# EAGLE design uBoard breakoutboard (EAGLE 5.00)
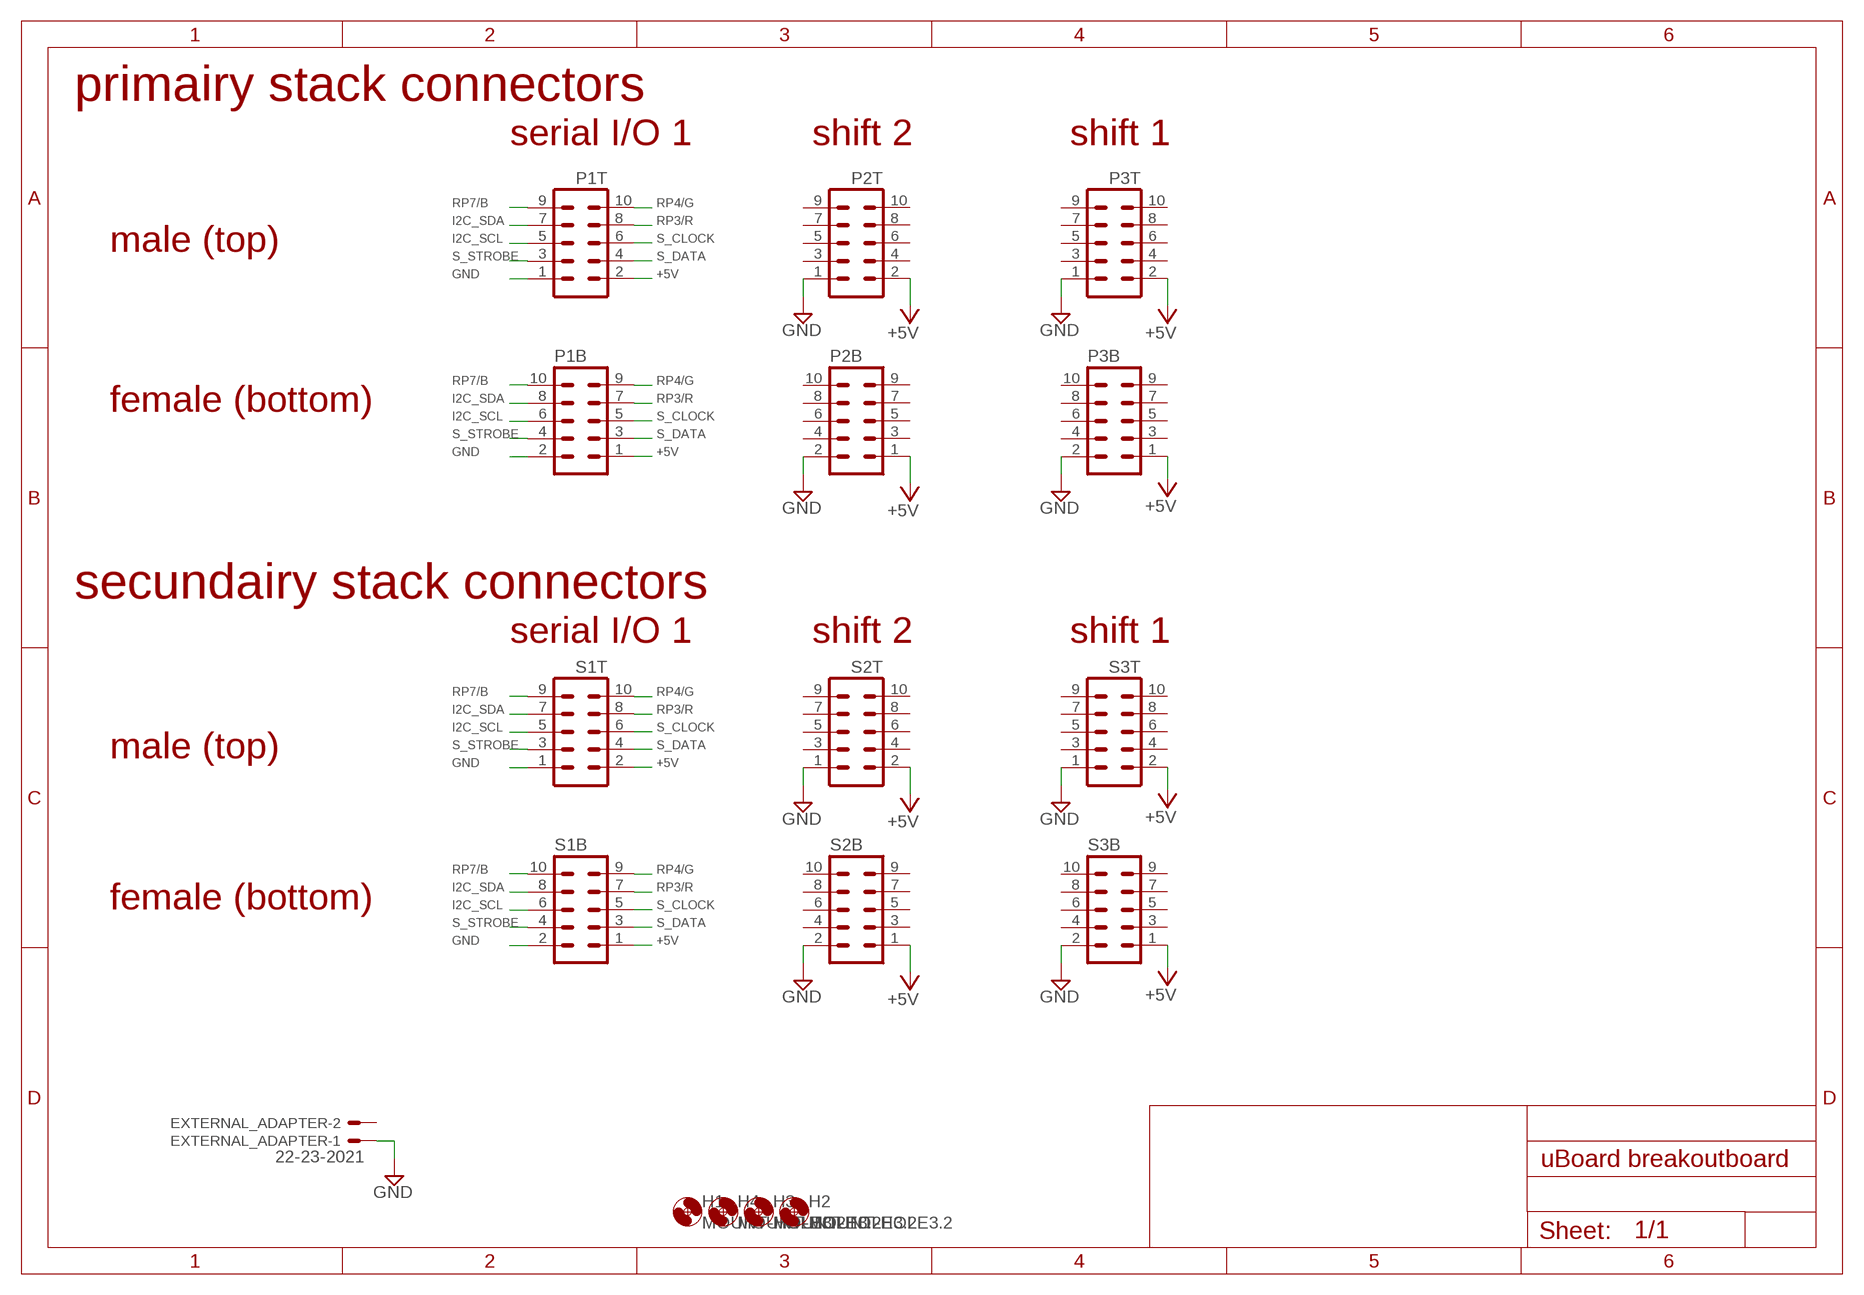
[diagram p0: schematic, sheet 1]

## Parts
EXTERNAL_ADAPTER  22-23-2021  [22-23-2021]
H1  MOUNT-HOLE3.2  [3,2]
H2  MOUNT-HOLE3.2  [3,2]
H3  MOUNT-HOLE3.2  [3,2]
H4  MOUNT-HOLE3.2  [3,2]
P1B  ML10  [ML10]
P1T  MA05-2  [MA05-2]
P2B  ML10  [ML10]
P2T  MA05-2  [MA05-2]
P3B  ML10  [ML10]
P3T  MA05-2  [MA05-2]
S1B  ML10  [ML10]
S1T  MA05-2  [MA05-2]
S2B  ML10  [ML10]
S2T  MA05-2  [MA05-2]
S3B  ML10  [ML10]
S3T  MA05-2  [MA05-2]

## Nets
+5V: P1B.1 P1T.2 P2B.1 P2T.2 P3B.1 P3T.2 S1B.1 S1T.2 S2B.1 S2T.2 S3B.1 S3T.2
GND: EXTERNAL_ADAPTER.1 P1B.2 P1T.1 P2B.2 P2T.1 P3B.2 P3T.1 S1B.2 S1T.1 S2B.2 S2T.1 S3B.2 S3T.1
I2C_SCL: P1B.6 P1T.5 S1B.6 S1T.5
I2C_SDA: P1B.8 P1T.7 S1B.8 S1T.7
RP3/R: P1B.7 P1T.8 S1B.7 S1T.8
RP4/G: P1B.9 P1T.10 S1B.9 S1T.10
RP7/B: P1B.10 P1T.9 S1B.10 S1T.9
S_CLOCK: P1B.5 P1T.6 S1B.5 S1T.6
S_DATA: P1B.3 P1T.4 S1B.3 S1T.4
S_STROBE: P1B.4 P1T.3 S1B.4 S1T.3
Unconnected: EXTERNAL_ADAPTER.2 P2B.3 P2B.4 P2B.5 P2B.6 P2B.7 P2B.8 P2B.9 P2B.10 P2T.3 P2T.4 P2T.5 P2T.6 P2T.7 P2T.8 P2T.9 P2T.10 P3B.3 P3B.4 P3B.5 P3B.6 P3B.7 P3B.8 P3B.9 P3B.10 P3T.3 P3T.4 P3T.5 P3T.6 P3T.7 P3T.8 P3T.9 P3T.10 S2B.3 S2B.4 S2B.5 S2B.6 S2B.7 S2B.8 S2B.9 S2B.10 S2T.3 S2T.4 S2T.5 S2T.6 S2T.7 S2T.8 S2T.9 S2T.10 S3B.3 S3B.4 S3B.5 S3B.6 S3B.7 S3B.8 S3B.9 S3B.10 S3T.3 S3T.4 S3T.5 S3T.6 S3T.7 S3T.8 S3T.9 S3T.10

## Notes on the sheet
- primairy stack connectors
- serial I/O 1 | shift 2 | shift 1
- male (top)
- female (bottom)
- secundairy stack connectors
- serial I/O 1 | shift 2 | shift 1
- male (top)
- female (bottom)

## Library data of the parts
EXTERNAL_ADAPTER = 12v connector:22-23-2021: .100" (2.54mm) Center Header - 2 Pin
H1-H4 = 0. workshop dsPIC:MOUNT-HOLE: MOUNTING HOLE with drill center marker
P1B P2B P3B S1B S2B S3B = 0. workshop dsPIC:ML10: HARTING
P1T P2T P3T S1T S2T S3T = con-lstb:MA05-2: PIN HEADER

## Board
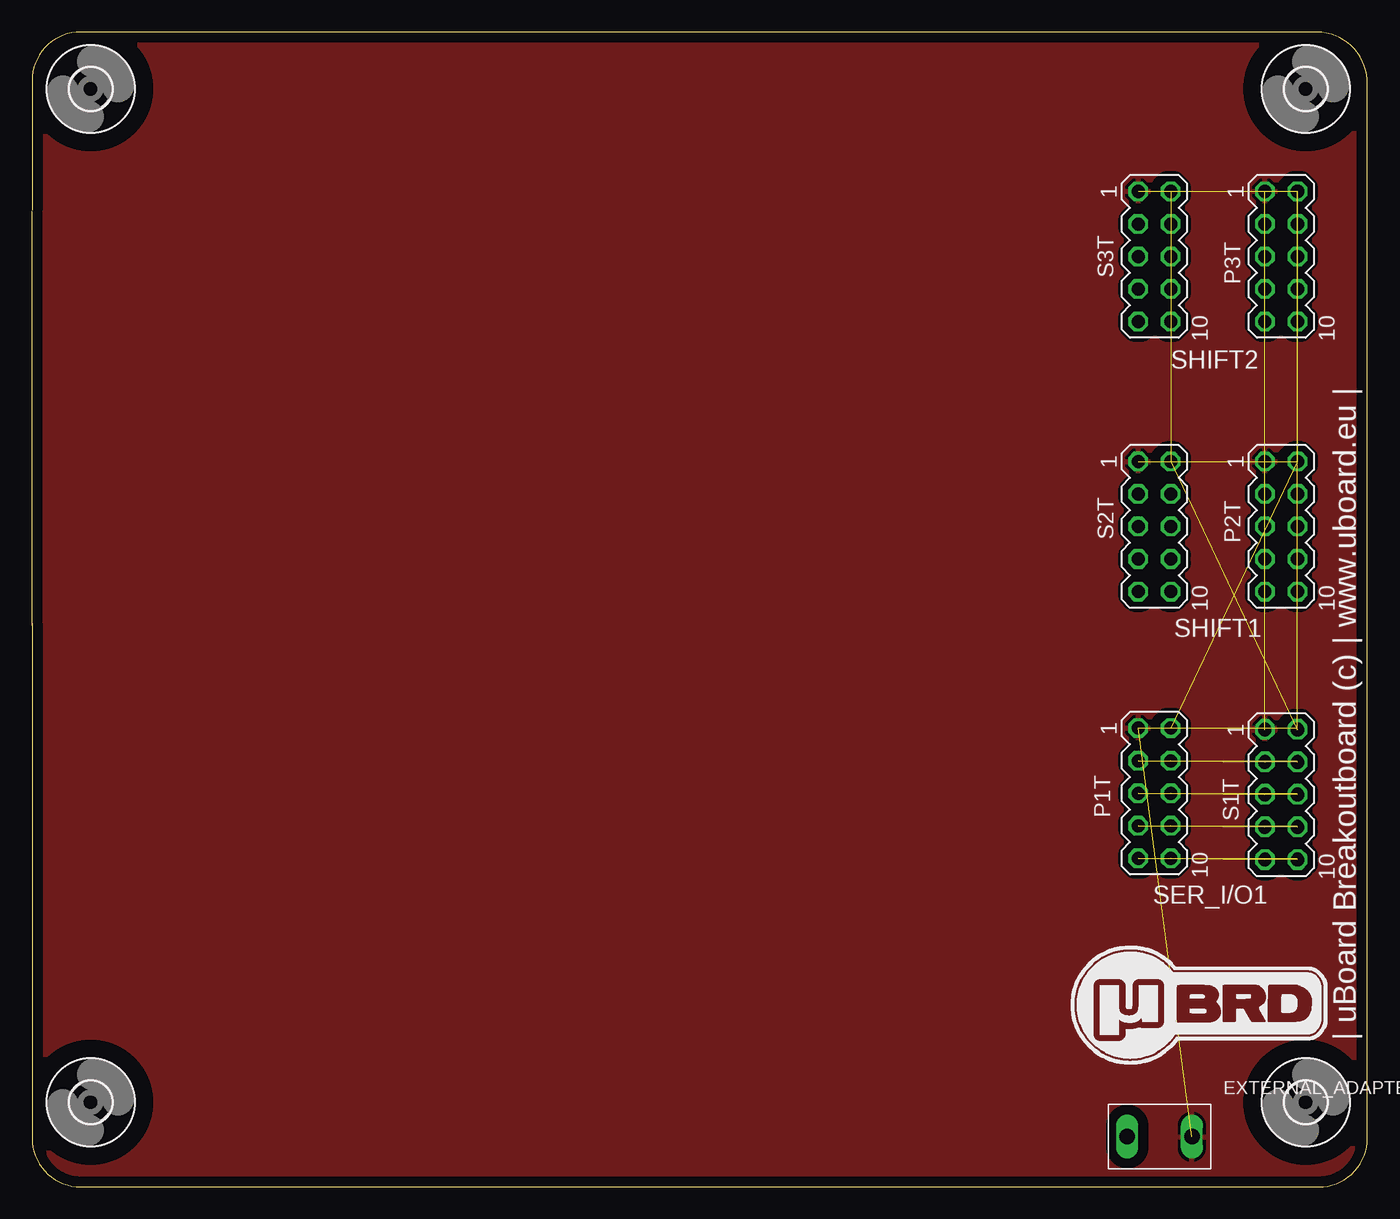
[diagram p1: board, top side]
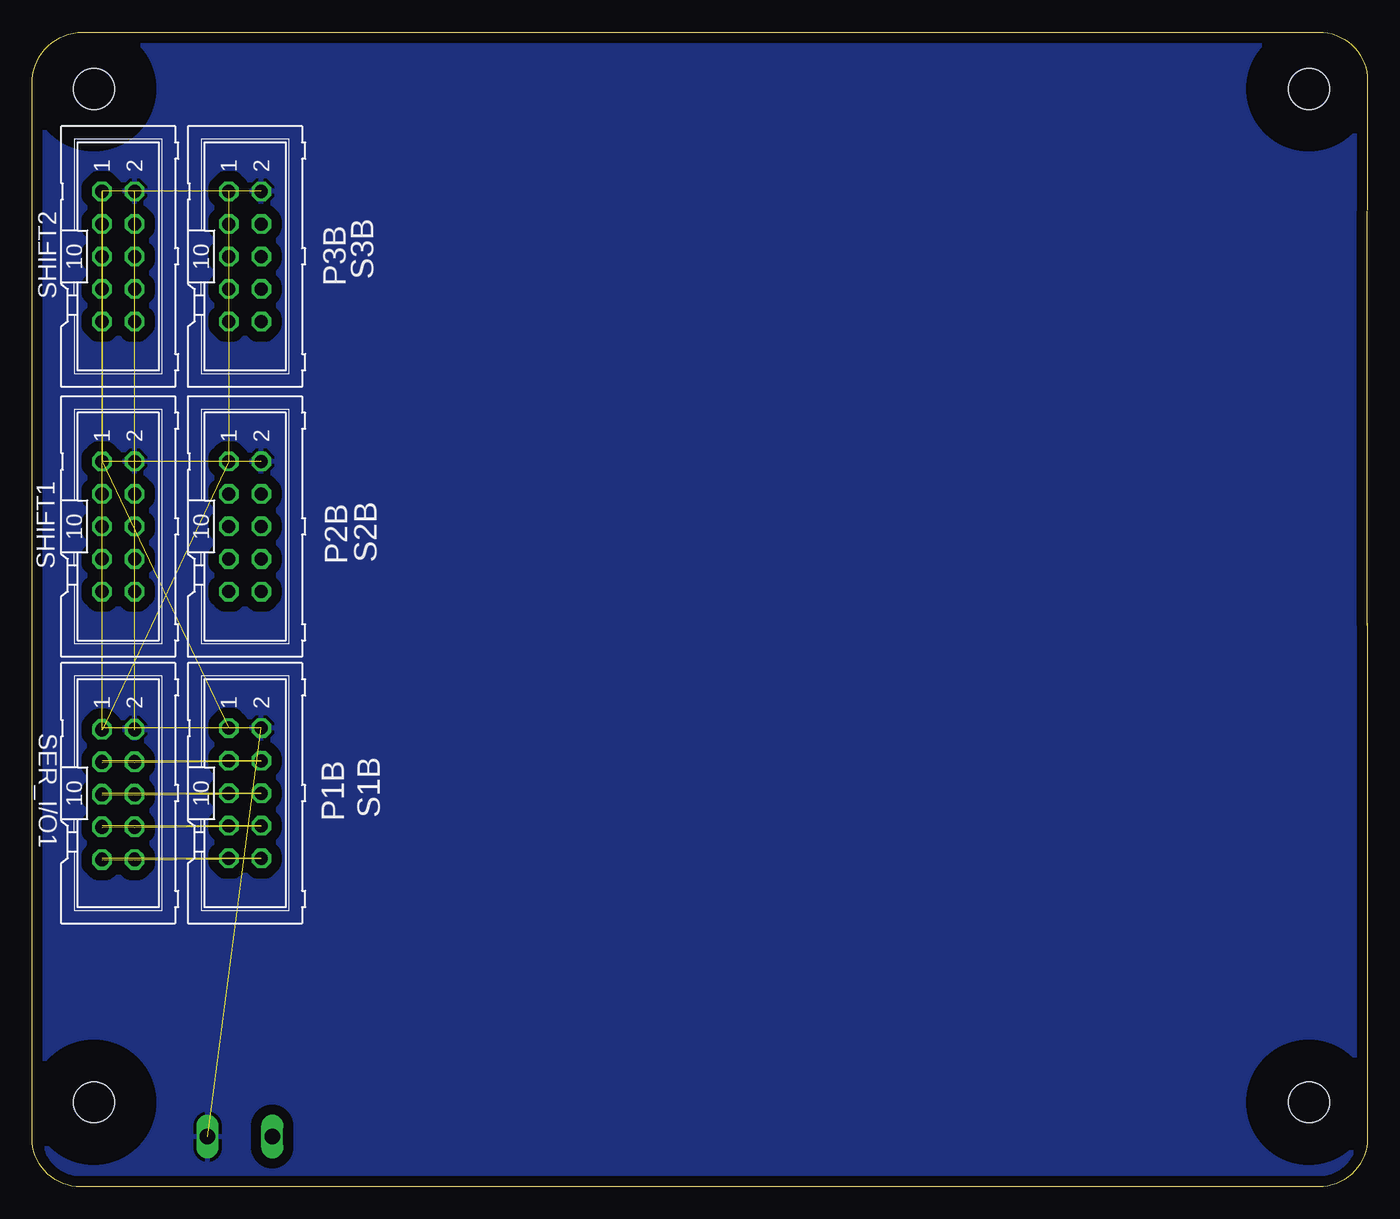
[diagram p2: board, bottom side, seen from below]

Size 104.27 x 90.17 mm. Coordinates in mm from the lower left corner, seen from the top.
Outline: 0,76.27 0,86.36 arc-90 3.81,90.17 100.33,90.17 arc-90 104.27,86.11 104.27,3.81 arc-90 100.46,0 3.81,0 arc-90 0,3.81 0,43.81
Outline: 0,44 0,43.81
Outline: 0,43.81 0,76.2
Copper layers (1*16): Top 0.035mm / dielectric 1.5mm / Bottom 0.035mm
Design rules "default *": minimum track width 10mil, minimum drill 0.6mm, track to track 8mil, track to pad 8mil, pad to pad 8mil, via to via 8mil, smd to smd 8mil, copper to edge 8mil, drill to drill 8mil, minimum pad ring 10mil, minimum via ring 8mil, stop-mask expansion 4mil, vias tented up to drill 0mil, thermal gap 10mil

### Footprints (pad centres in the part's own frame; a part is rotated, then mirrored left to right if it is on the bottom)
22-23-2021 = drill 1.2 long: 1 0.009,0.492; 2 -5.04,0.5
3,2 = hole 3.2: 0,0
ML10 = drill 0.914 octagon: 1 -5.08,-1.27; 2 -5.08,1.27; 3 -2.54,-1.27; 4 -2.54,1.27; 5 0,-1.27; 6 0,1.27; 7 2.54,-1.27; 8 2.54,1.27; 9 5.08,-1.27; 10 5.08,1.27
MA05-2 = drill 1.016 octagon: 1 -5.08,-1.27; 2 -5.08,1.27; 3 -2.54,-1.27; 4 -2.54,1.27; 5 0,-1.27; 6 0,1.27; 7 2.54,-1.27; 8 2.54,1.27; 9 5.08,-1.27; 10 5.08,1.27

### Placement (x,y rotation side)
EXTERNAL_ADAPTER  90.55,3.43 0 top
H1  99.44,6.6 0 top
H2  4.57,6.6 0 top
H3  4.57,85.72 0 top
H4  99.44,85.72 0 top
P1B  97.54,30.73 270 bottom
P1T  87.63,30.73 270 top
P2B  97.54,51.56 270 bottom
P2T  97.54,51.56 270 top
P3B  97.54,72.64 270 bottom
P3T  97.54,72.64 270 top
S1B  87.63,30.73 270 bottom
S1T  97.54,30.61 270 top
S2B  87.63,51.56 270 bottom
S2T  87.63,51.56 270 top
S3B  87.63,72.64 270 bottom
S3T  87.63,72.64 270 top

### Tracks (layer width: path | path; a pad name or v marks a point on that pad's centre or on a via)
+5V  (10 unrouted)
GND  (7 unrouted)
  pour Bottom (isolate 0.813): 105.03,90.93 105.16,-0.76 -0.64,-0.51 -0.76,90.68
  pour Top (isolate 0.813): -0.64,90.68 105.03,90.93 105.16,-0.76 17.72,-0.64 -0.67,-0.51 -0.7,12.99
I2C_SCL  (2 unrouted)
I2C_SDA  (2 unrouted)
RP3/R  (2 unrouted)
RP4/G  (2 unrouted)
RP7/B  (2 unrouted)
S_CLOCK  (2 unrouted)
S_DATA  (2 unrouted)
S_STROBE  (2 unrouted)

### Text on the board
tPlace: SHIFT2 | SHIFT1 | SER_I/O1
bPlace: SHIFT2 | SHIFT1 | SER_I/O1
tNames: | uBoard Breakoutboard (c) | www.uboard.eu |